# EAGLE schematic octanis_eps_v1 (EAGLE 7.2.0)
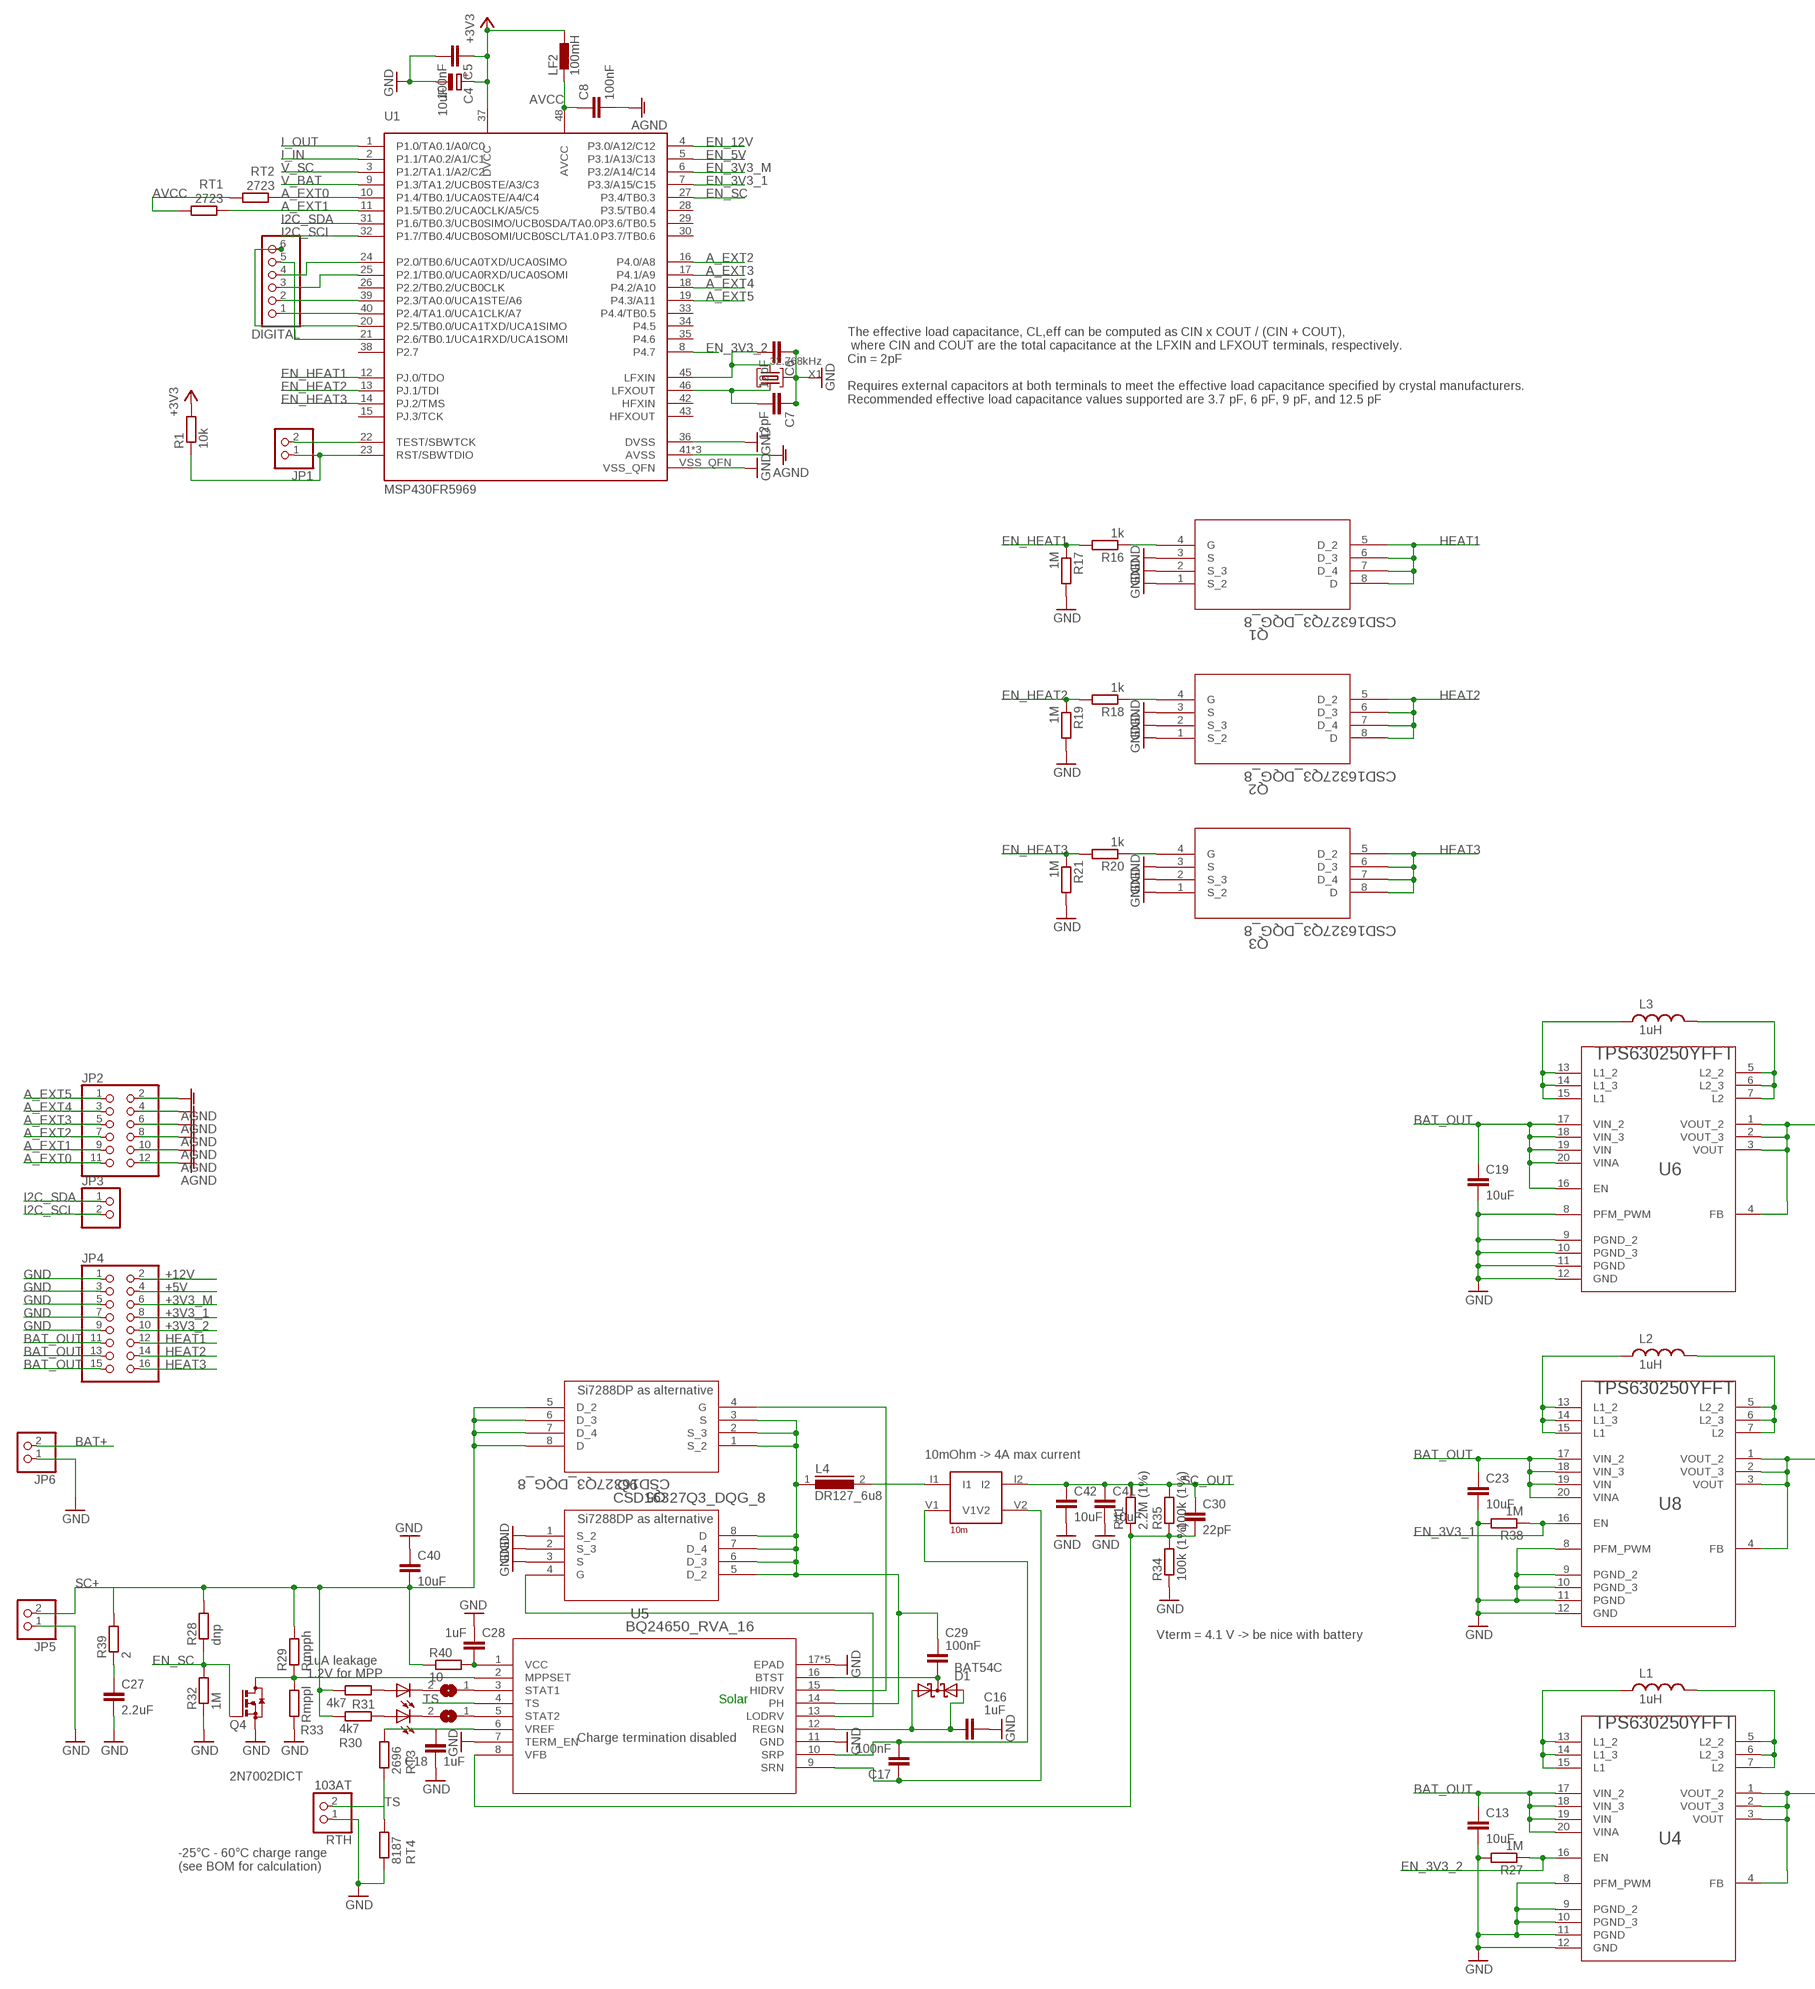
[diagram p0: schematic, sheet 1, part 1 of 2]
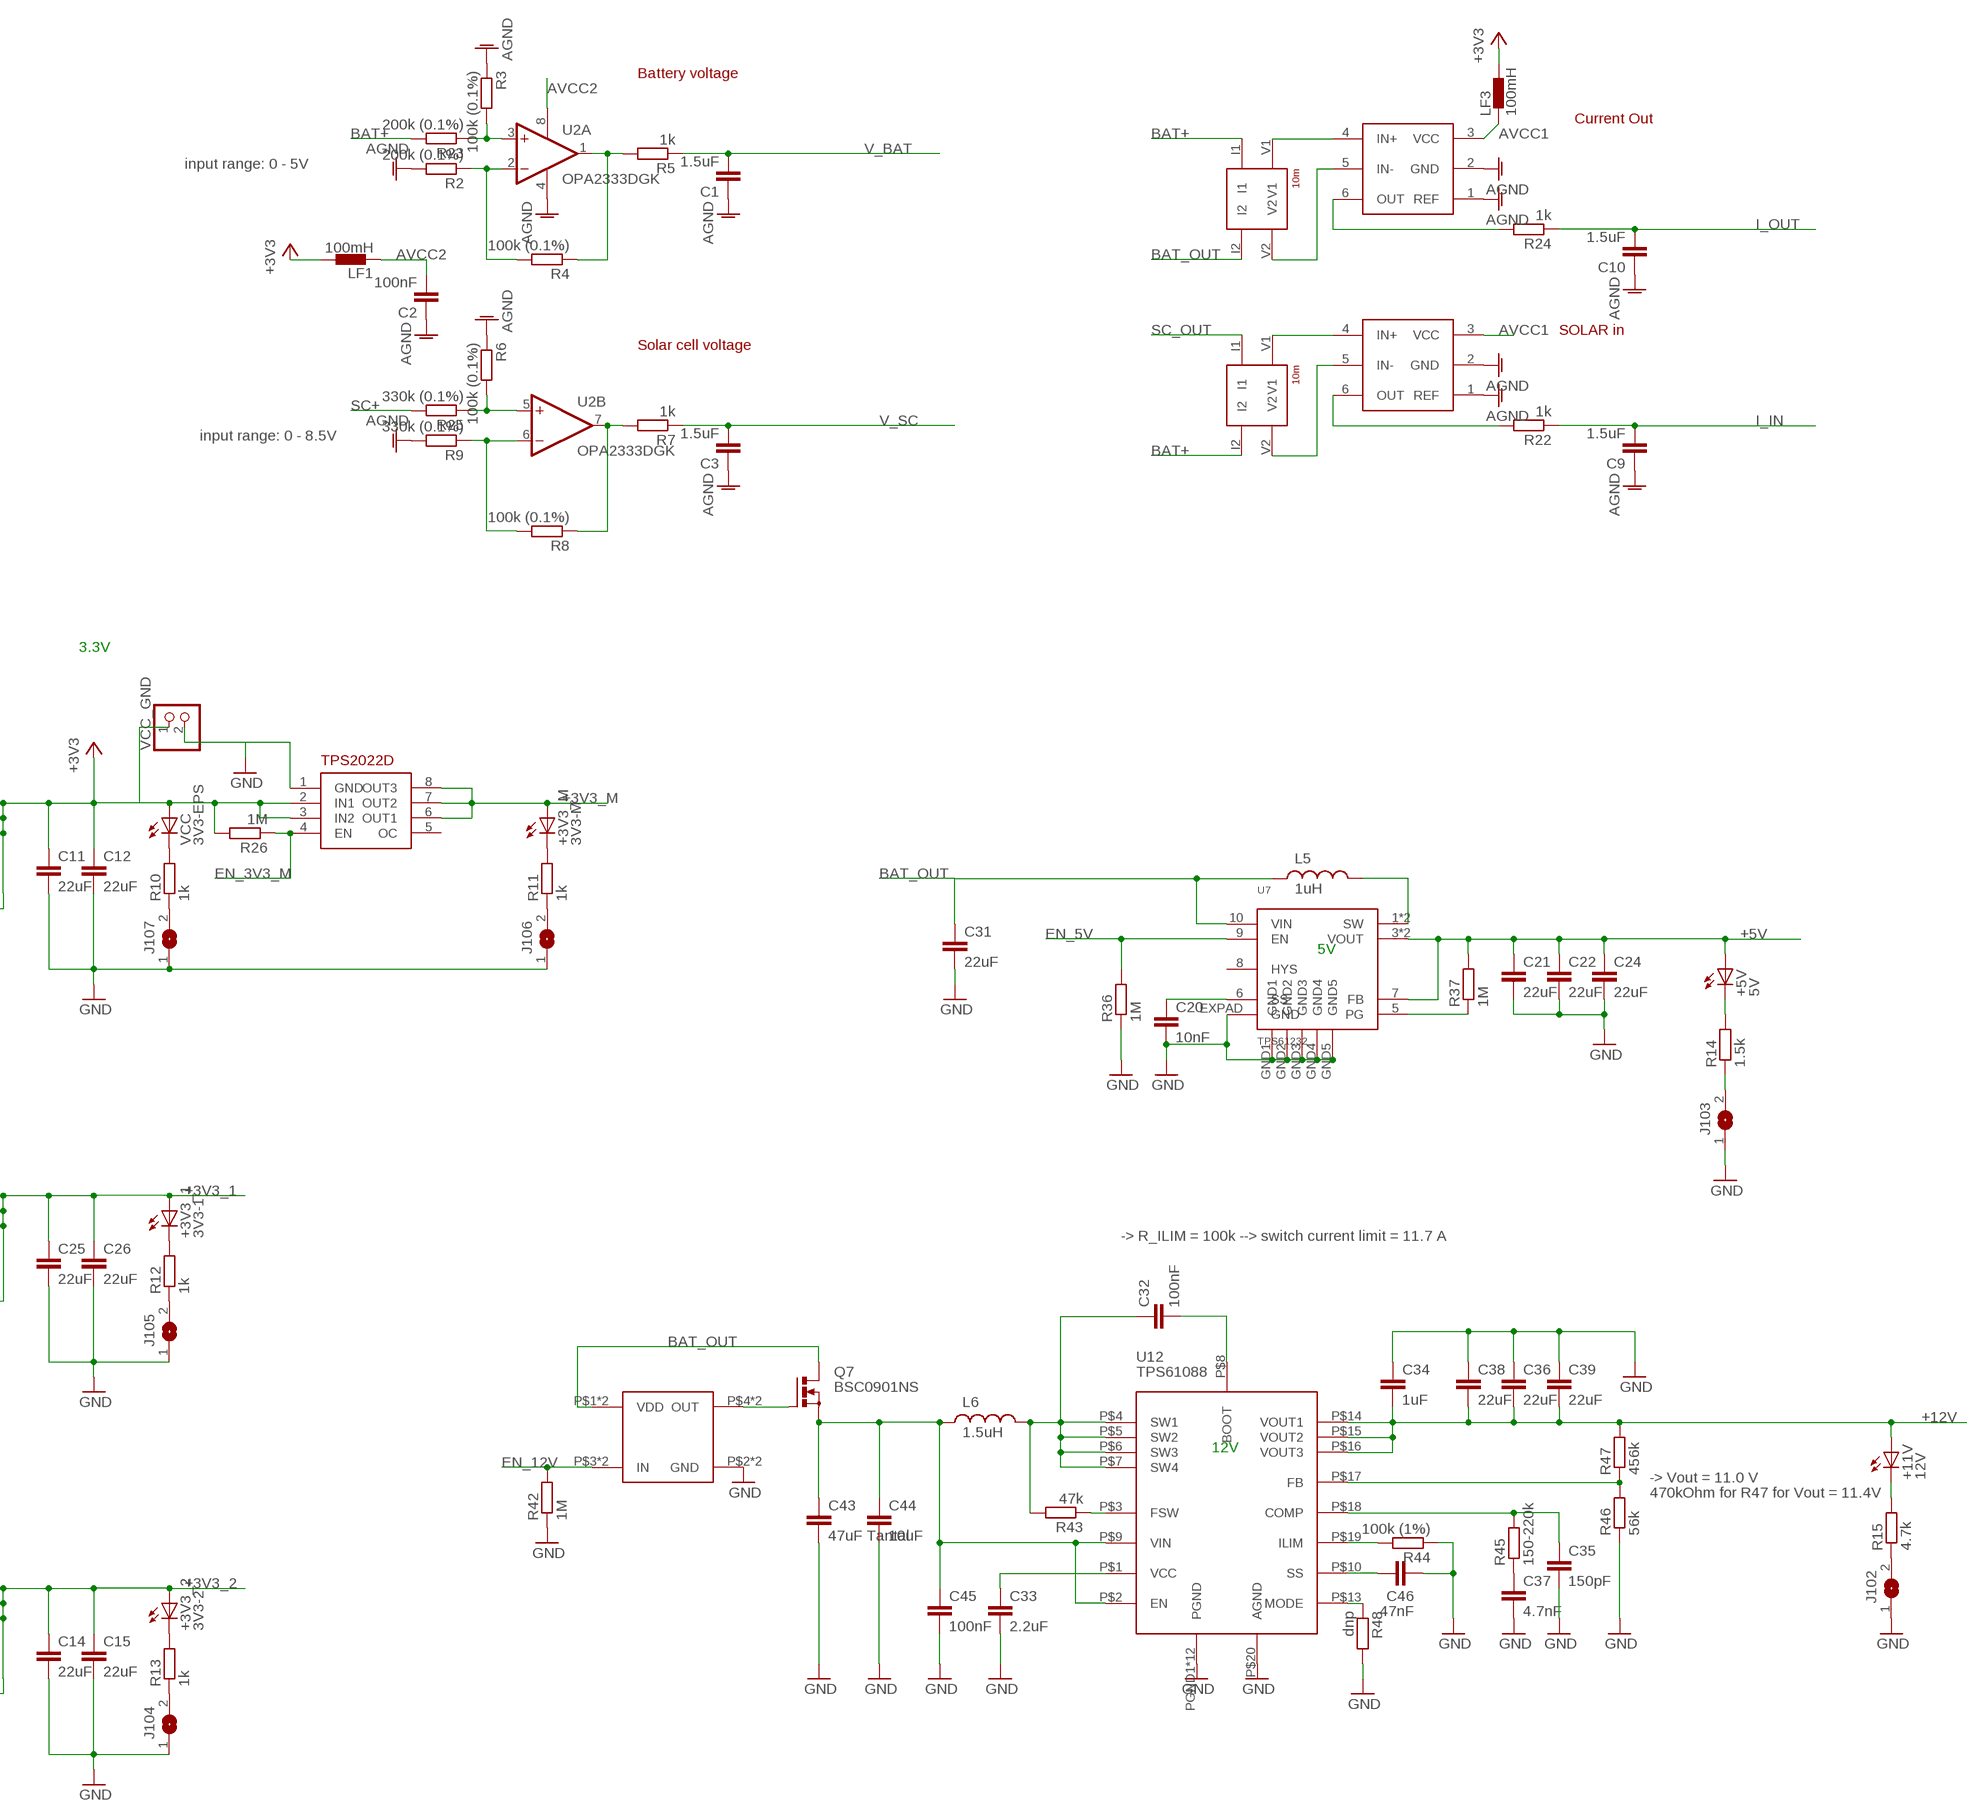
[diagram p1: schematic, sheet 1, part 2 of 2]

## Parts
+3V3_1  3V3-1  LEDCHIPLED_0603  [CHIPLED_0603]
+3V3_2  3V3-2  LEDCHIPLED_0603  [CHIPLED_0603]
+3V3_M  3V3-M  LEDCHIPLED_0603  [CHIPLED_0603]
+5V  5V  LEDCHIPLED_0603  [CHIPLED_0603]
+11V  12V  LEDCHIPLED_0603  [CHIPLED_0603]
C1  1.5uF  C-EUC0603  [C0603]
C2  100nF  C-EUC0603  [C0603]
C3  1.5uF  C-EUC0603  [C0603]
C4  10uF  CPOL-EUA/3216-18R  [A/3216-18R]
C5  100nF  C-EUC0603  [C0603]
C6  12pF  C-EUC0603  [C0603]
C7  12pF  C-EUC0603  [C0603]
C8  100nF  C-EUC0603  [C0603]
C9  1.5uF  C-EUC0603  [C0603]
C10  1.5uF  C-EUC0603  [C0603]
C11  22uF  C-EUC0805  [C0805]
C12  22uF  C-EUC0805  [C0805]
C13  10uF  C-EUC0805  [C0805]
C14  22uF  C-EUC0805  [C0805]
C15  22uF  C-EUC0805  [C0805]
C16  1uF  C-EUC0603  [C0603]
C17  100nF  C-EUC0603  [C0603]
C18  1uF  C-EUC0603  [C0603]
C19  10uF  C-EUC0805  [C0805]
C20  10nF  C-EUC0603  [C0603]
C21  22uF  C-EUC0805  [C0805]
C22  22uF  C-EUC0805  [C0805]
C23  10uF  C-EUC0805  [C0805]
C24  22uF  C-EUC0805  [C0805]
C25  22uF  C-EUC0805  [C0805]
C26  22uF  C-EUC0805  [C0805]
C27  2.2uF  C-EUC0603  [C0603]
C28  1uF  C-EUC0603  [C0603]
C29  100nF  C-EUC0603  [C0603]
C30  22pF  C-EUC0603  [C0603]
C31  22uF  C-EUC0603  [C0603]
C32  100nF  C-EUC0603  [C0603]
C33  2.2uF  C-EUC0603  [C0603]
C34  1uF  C-EUC0603  [C0603]
C35  150pF  C-EUC0603  [C0603]
C36  22uF  C-EUC0805  [C0805]
C37  4.7nF  C-EUC0603  [C0603]
C38  22uF  C-EUC0805  [C0805]
C39  22uF  C-EUC0805  [C0805]
C40  10uF  C-EUC0805  [C0805]
C41  10uF  C-EUC0805  [C0805]
C42  10uF  C-EUC0805  [C0805]
C43  47uF Tantal  C-EUC1210  [C1210]
C44  10uF  C-EUC0805  [C0805]
C45  100nF  C-EUC0603  [C0603]
C46  47nF  C-EUC0603  [C0603]
D1  BAT54C  [SOT23]
DIGITAL  PINHD-1X6B  [1X06-BIG]
J100  SJ  [SJ]
J101  SJ  [SJ]
J102  SJ  [SJ]
J103  SJ  [SJ]
J104  SJ  [SJ]
J105  SJ  [SJ]
J106  SJ  [SJ]
J107  SJ  [SJ]
JP1  PINHD-1X2  [1X02]
JP2  PINHD-2X6  [2X06]
JP3  PINHD-1X2  [1X02]
JP4  PINHD-2X8  [2X08]
JP5  PINHD-1X2  [1X02]
JP6  PINHD-1X2  [1X02]
L1  1uH  XFL4020  [XFL4020]
L2  1uH  XFL4020  [XFL4020]
L3  1uH  XFL4020  [XFL4020]
L4  DR127_6u8  DR127  [DR127]
L5  1uH  XFL4020  [XFL4020]
L6  1.5uH  XFL4020  [XFL4020]
LF1  100mH  BLM15HD601SN1  [0402]
LF2  100mH  BLM15HD601SN1  [0402]
LF3  100mH  BLM15HD601SN1  [0402]
Q1  CSD16327Q3_DQG_8  [DQG8]
Q2  CSD16327Q3_DQG_8  [DQG8]
Q3  CSD16327Q3_DQG_8  [DQG8]
Q4  BSS123  [SOT23]
Q5  CSD16327Q3_DQG_8  [DQG8]
Q6  CSD16327Q3_DQG_8  [DQG8]
Q7  BSC0901NS  BSC340N08NS3G  [PG-TDSON-8]
R1  10k  R-EU_R0603  [R0603]
R2  200k (0.1%)  R-EU_R0603  [R0603]
R3  100k (0.1%)  R-EU_R0603  [R0603]
R4  100k (0.1%)  R-EU_R0603  [R0603]
R5  1k  R-EU_R0603  [R0603]
R6  100k (0.1%)  R-EU_R0603  [R0603]
R7  1k  R-EU_R0603  [R0603]
R8  100k (0.1%)  R-EU_R0603  [R0603]
R9  330k (0.1%)  R-EU_R0603  [R0603]
R10  1k  R-EU_R0603  [R0603]
R11  1k  R-EU_R0603  [R0603]
R12  1k  R-EU_R0603  [R0603]
R13  1k  R-EU_R0603  [R0603]
R14  1.5k  R-EU_R0603  [R0603]
R15  4.7k  R-EU_R0603  [R0603]
R16  1k  R-EU_R0603  [R0603]
R17  1M  R-EU_R0603  [R0603]
R18  1k  R-EU_R0603  [R0603]
R19  1M  R-EU_R0603  [R0603]
R20  1k  R-EU_R0603  [R0603]
R21  1M  R-EU_R0603  [R0603]
R22  1k  R-EU_R0603  [R0603]
R23  200k (0.1%)  R-EU_R0603  [R0603]
R24  1k  R-EU_R0603  [R0603]
R25  330k (0.1%)  R-EU_R0603  [R0603]
R26  1M  R-EU_R0603  [R0603]
R27  1M  R-EU_R0603  [R0603]
R28  dnp  R-EU_R0603  [R0603]
R29  Rmpph  R-EU_R0603  [R0603]
R30  4k7  R-EU_R0603  [R0603]
R31  4k7  R-EU_R0603  [R0603]
R32  1M  R-EU_R0603  [R0603]
R33  Rmppl  R-EU_R0603  [R0603]
R34  100k (1%)  R-EU_R0603  [R0603]
R35  100k (1%)  R-EU_R0603  [R0603]
R36  1M  R-EU_R0603  [R0603]
R37  1M  R-EU_R0603  [R0603]
R38  1M  R-EU_R0603  [R0603]
R39  2  R-EU_R2010  [R2010]
R40  10  R-EU_R1206  [R1206]
R41  2.2M (1%)  R-EU_R0603  [R0603]
R42  1M  R-EU_R0603  [R0603]
R43  47k  R-EU_R0603  [R0603]
R44  100k (1%)  R-EU_R0603  [R0603]
R45  150-220k  R-EU_R0603  [R0603]
R46  56k  R-EU_R0603  [R0603]
R47  456k  R-EU_R0603  [R0603]
R48  dnp  R-EU_R0603  [R0603]
RS1  10m  CURRENT_RESISTOR  [4PADS_RESISTOR]
RS2  10m  CURRENT_RESISTOR  [4PADS_RESISTOR]
RS3  10m  CURRENT_RESISTOR  [4PADS_RESISTOR]
RT1  2723  R-EU_R0603  [R0603]
RT2  2723  R-EU_R0603  [R0603]
RT3  2696  R-EU_R0603  [R0603]
RT4  8187  R-EU_R0603  [R0603]
RTH  103AT  PINHD-1X2  [1X02]
STAT1  5V-ok  LEDCHIPLED_0603  [CHIPLED_0603]
STAT2  5V-ok  LEDCHIPLED_0603  [CHIPLED_0603]
U1  MSP430FR5969  [S-PVQFN-N48]
U2  OPA2333DGK  [MSOP08]
U3  TPS2022D  [SO8]
U4  TPS630250YFFT  [YFF0020AEBA]
U5  BQ24650_RVA_16  [RVA16_2P14X2P14]
U6  TPS630250YFFT  [YFF0020AEBA]
U7  TPS61232  [S-PVSON-N10]
U8  TPS630250YFFT  [YFF0020AEBA]
U9  INA213  [SC70-6]
U10  INA213  [SC70-6]
U11  MIC5019  [QFN-4]
U12  TPS61088  [R-PVQFN-N20]
VCC  3V3-EPS  LEDCHIPLED_0603  [CHIPLED_0603]
VCC_GND  PINHD-1X2  [1X02]
X1  32.768kHz  MS3V-T1R  [MS3V-T1R]

## Nets
+3V3: C4.+ C5.1 C11.1 C12.1 LF1.2 LF2.2 LF3.2 R1.2 R26.2 U1.37(DVCC) U3.2(IN1) U3.3(IN2) U6.1(VOUT_2) U6.2(VOUT_3) U6.3(VOUT) U6.4(FB) VCC.A VCC_GND.1
+3V3_1: +3V3_1.A C25.1 C26.1 JP4.8 U8.1(VOUT_2) U8.2(VOUT_3) U8.3(VOUT) U8.4(FB)
+3V3_2: +3V3_2.A C14.1 C15.1 JP4.10 U4.1(VOUT_2) U4.2(VOUT_3) U4.3(VOUT) U4.4(FB)
+3V3_M: +3V3_M.A JP4.6 U3.6(OUT1) U3.7(OUT2) U3.8(OUT3)
+5V [fine]: +5V.A C21.1 C22.1 C24.1 JP4.4 R37.2 U7.3(VOUT) U7.4(VOUT) U7.7(FB)
+12V [fine]: +11V.A C34.2 C36.2 C38.2 C39.2 JP4.2 R47.2 U12.P$14(VOUT1) U12.P$15(VOUT2) U12.P$16(VOUT3)
A_EXT0: JP2.11 RT2.2 U1.10(P1.4/TB0.1/UCA0STE/A4/C4)
A_EXT1: JP2.9 RT1.2 U1.11(P1.5/TB0.2/UCA0CLK/A5/C5)
A_EXT2: JP2.7 U1.16(P4.0/A8)
A_EXT3: JP2.5 U1.17(P4.1/A9)
A_EXT4: JP2.3 U1.18(P4.2/A10)
A_EXT5: JP2.1 U1.19(P4.3/A11)
AGND: C1.1 C2.1 C3.1 C8.2 C9.1 C10.1 JP2.2 JP2.4 JP2.6 JP2.8 JP2.10 JP2.12 R2.2 R3.1 R6.1 R9.2 U1.41(AVSS) U1.44(AVSS) U1.47(AVSS) U2.4(P:V-) U9.1(REF) U9.2(GND) U10.1(REF) U10.2(GND)
AVCC: C8.1 LF2.1 RT1.1 RT2.1 U1.48(AVCC)
AVCC1: LF3.1 U9.3(VCC) U10.3(VCC)
AVCC2: C2.2 LF1.1 U2.8(P:V+)
BAT+: JP6.2 R23.2 RS2.I2 RS3.I1
BAT_11V: C43.1 C44.1 C45.1 L6.P$1 Q7.1(S) Q7.2(S) Q7.3(S) U12.P$2(EN) U12.P$9(VIN)
BAT_OUT: C13.1 C19.1 C23.1 C31.1 JP4.11 JP4.13 JP4.15 L5.P$1 Q7.5(D) Q7.6(D) Q7.7(D) Q7.8(D) RS3.I2 U4.17(VIN_2) U4.18(VIN_3) U4.19(VIN) U4.20(VINA) U6.16(EN) U6.17(VIN_2) U6.18(VIN_3) U6.19(VIN) U6.20(VINA) U7.10(VIN) U8.17(VIN_2) U8.18(VIN_3) U8.19(VIN) U8.20(VINA) U11.P1(VDD) U11.P$1(VDD)
EN_3V3_1: R38.1 U1.7(P3.3/A15/C15) U8.16(EN)
EN_3V3_2: R27.1 U1.8(P4.7) U4.16(EN)
EN_3V3_M: R26.1 U1.6(P3.2/A14/C14) U3.4(EN)
EN_5V: R36.2 U1.5(P3.1/A13/C13) U7.9(EN)
EN_12V: R42.2 U1.4(P3.0/A12/C12) U11.P3(IN) U11.P$3(IN)
EN_HEAT1: R16.2 R17.1 U1.12(PJ.0/TDO)
EN_HEAT2: R18.2 R19.1 U1.13(PJ.1/TDI)
EN_HEAT3: R20.2 R21.1 U1.14(PJ.2/TMS)
EN_SC: Q4.1(G) R28.1 R32.2 U1.27(P3.4/TB0.3)
GND [power]: C4.- C5.2 C6.1 C7.1 C11.2 C12.2 C13.2 C14.2 C15.2 C16.2 C18.2 C19.2 C20.2 C21.2 C22.2 C23.2 C24.2 C25.2 C26.2 C27.2 C28.2 C31.2 C33.2 C34.1 C35.2 C36.1 C37.2 C38.1 C39.1 C40.1 C41.2 C42.2 C43.2 C44.2 C45.2 C46.2 J102.1 J103.1 J104.1 J105.1 J106.1 J107.1 JP4.1 JP4.3 JP4.5 JP4.7 JP4.9 JP5.1 JP6.1 Q1.1(S_2) Q1.2(S_3) Q1.3(S) Q2.1(S_2) Q2.2(S_3) Q2.3(S) Q3.1(S_2) Q3.2(S_3) Q3.3(S) Q4.2(S) Q6.1(S_2) Q6.2(S_3) Q6.3(S) R17.2 R19.2 R21.2 R27.2 R32.1 R33.1 R34.1 R36.1 R38.2 R42.1 R44.1 R46.1 R48.2 RT4.2 RTH.1 U1.36(DVSS) U1.VSS_QFN U3.1(GND) U4.8(PFM_PWM) U4.9(PGND_2) U4.10(PGND_3) U4.11(PGND) U4.12(GND) U5.7(TERM_EN) U5.11(GND) U5.17(EPAD) U5.V(EPAD) U5.V_1(EPAD) U5.V_2(EPAD) U5.V_3(EPAD) U6.8(PFM_PWM) U6.9(PGND_2) U6.10(PGND_3) U6.11(PGND) U6.12(GND) U7.EXPAD(GND) U7.GND1 U7.GND2 U7.GND3 U7.GND4 U7.GND5 U8.8(PFM_PWM) U8.9(PGND_2) U8.10(PGND_3) U8.11(PGND) U8.12(GND) U11.P2(GND) U11.P$2(GND) U12.P$20(AGND) U12.PGND1(PGND) U12.PGND2(PGND) U12.PGND3(PGND) U12.PGND4(PGND) U12.PGND5(PGND) U12.PGND6(PGND) U12.PGND7(PGND) U12.PGND8(PGND) U12.PGND9(PGND) U12.PGND10(PGND) U12.PGND11(PGND) U12.PGND12(PGND) VCC_GND.2 X1.P3(GND)
HEAT1: JP4.12 Q1.5(D_2) Q1.6(D_3) Q1.7(D_4) Q1.8(D)
HEAT2: JP4.14 Q2.5(D_2) Q2.6(D_3) Q2.7(D_4) Q2.8(D)
HEAT3: JP4.16 Q3.5(D_2) Q3.6(D_3) Q3.7(D_4) Q3.8(D)
I2C_SCL: JP3.2 U1.32(P1.7/TB0.4/UCB0SOMI/UCB0SCL/TA1.0)
I2C_SDA: JP3.1 U1.31(P1.6/TB0.3/UCB0SIMO/UCB0SDA/TA0.0)
I_IN: C9.2 R22.1 U1.2(P1.1/TA0.2/A1/C1)
I_OUT: C10.2 R24.1 U1.1(P1.0/TA0.1/A0/C0)
IND: L5.P$2 U7.1(SW) U7.2(SW)
LED5: +5V.C R14.2
N$1: L3.P$1 U6.13(L1_2) U6.14(L1_3) U6.15(L1)
N$2: R37.1 U7.5(PG)
N$3: L3.P$2 U6.5(L2_2) U6.6(L2_3) U6.7(L2)
N$4: L4.2 RS1.I1
N$5: C20.1 U7.6(SS)
N$6: L2.P$1 U8.13(L1_2) U8.14(L1_3) U8.15(L1)
N$7: L2.P$2 U8.5(L2_2) U8.6(L2_3) U8.7(L2)
N$9: R48.1 U12.P$13(MODE)
N$10: Q7.4(G) U11.P4(OUT) U11.P$4(OUT)
N$11: L1.P$1 U4.13(L1_2) U4.14(L1_3) U4.15(L1)
N$12: L1.P$2 U4.5(L2_2) U4.6(L2_3) U4.7(L2)
N$13: JP1.1 R1.1 U1.23(RST/SBWTDIO)
N$14: J103.2 R14.1
N$15: JP1.2 U1.22(TEST/SBWTCK)
N$16: C7.2 U1.46(LFXOUT) X1.P1
N$17: C6.2 U1.45(LFXIN) X1.P2
N$18: DIGITAL.3 U1.25(P2.1/TB0.0/UCA0RXD/UCA0SOMI)
N$19: R4.1 R5.2 U2.1(A:OUT)
N$20: R2.1 R4.2 U2.2(A:-IN)
N$21: R3.2 R23.1 U2.3(A:+IN)
N$22: R7.2 R8.1 U2.7(B:OUT)
N$23: R8.2 R9.1 U2.6(B:-IN)
N$24: R6.2 R25.1 U2.5(B:+IN)
N$25: R24.2 U10.6(OUT)
N$26: R22.2 U9.6(OUT)
N$27: Q3.4(G) R20.1
N$28: DIGITAL.4 U1.24(P2.0/TB0.6/UCA0TXD/UCA0SIMO)
N$29: DIGITAL.2 U1.39(P2.3/TA0.0/UCA1STE/A6)
N$30: DIGITAL.1 U1.40(P2.4/TA1.0/UCA1CLK/A7)
N$31: Q2.4(G) R18.1
N$32: RS3.V1 U10.4(IN+)
N$33: RS3.V2 U10.5(IN-)
N$34: RS2.V1 U9.4(IN+)
N$35: RS2.V2 U9.5(IN-)
N$36: DIGITAL.5 U1.21(P2.6/TB0.1/UCA1RXD/UCA1SOMI)
N$37: Q1.4(G) R16.1
N$38: C32.2 U12.P$8(BOOT)
N$39: +3V3_M.C R11.2
N$40: J106.2 R11.1
N$41: DIGITAL.6 U1.20(P2.5/TB0.0/UCA1TXD/UCA1SIMO)
N$42: C27.1 R39.1
N$43: R10.2 VCC.C
N$45: J107.2 R10.1
N$46: +3V3_2.C R13.2
N$47: J104.2 R13.1
N$48: +11V.C R15.2
N$49: J102.2 R15.1
N$50: C32.1 L6.P$2 R43.2 U12.P$4(SW1) U12.P$5(SW2) U12.P$6(SW3) U12.P$7(SW4)
N$51: +3V3_1.C R12.2
N$52: J105.2 R12.1
N$53: R43.1 U12.P$3(FSW)
N$54: C37.1 R45.1
N$56: C46.1 U12.P$10(SS)
N$57: R44.2 U12.P$19(ILIM)
N$58: C35.1 R45.2 U12.P$18(COMP)
N$59: C33.1 U12.P$1(VCC)
N$60: R46.2 R47.1 U12.P$17(FB)
N$64: Q4.3(D) R29.1 R33.2 U5.2(MPPSET)
N$66: R31.1 STAT1.A
N$67: J101.2 STAT2.C
N$68: J100.2 STAT1.C
N$69: R30.1 STAT2.A
N$70: J101.1 U5.5(STAT2)
N$71: J100.1 U5.3(STAT1)
N$72: C18.1 RT3.1 U5.6(VREF)
N$73: C28.1 R40.2 U5.1(VCC)
N$76: C29.1 L4.1 Q5.1(S_2) Q5.2(S_3) Q5.3(S) Q6.5(D_2) Q6.6(D_3) Q6.7(D_4) Q6.8(D) U5.14(PH)
N$77: C17.2 RS1.V1 U5.10(SRP)
N$78: C17.1 RS1.V2 U5.9(SRN)
N$80: Q5.4(G) U5.15(HIDRV)
N$81: Q6.4(G) U5.13(LODRV)
N$82: C30.2 R34.2 R35.1 R41.1 U5.8(VFB)
N$84: C16.1 D1.1(A1) D1.2(A2) U5.12(REGN)
N$85: C29.2 D1.3(CC) U5.16(BTST)
SC+: C40.2 JP5.2 Q5.5(D_2) Q5.6(D_3) Q5.7(D_4) Q5.8(D) R25.2 R28.2 R29.2 R30.2 R31.2 R39.2 R40.1
SC_OUT: C30.1 C41.1 C42.1 R35.2 R41.2 RS1.I2 RS2.I1
TS: RT3.2 RT4.1 RTH.2 U5.4(TS)
V_BAT: C1.2 R5.1 U1.9(P1.3/TA1.2/UCB0STE/A3/C3)
V_SC: C3.2 R7.1 U1.3(P1.2/TA1.1/A2/C2)
Unconnected: Q7.TH U1.15(PJ.3/TCK) U1.26(P2.2/TB0.2/UCB0CLK) U1.28(P3.5/TB0.4) U1.29(P3.6/TB0.5) U1.30(P3.7/TB0.6) U1.33(P4.4/TB0.5) U1.34(P4.5) U1.35(P4.6) U1.38(P2.7) U1.42(HFXIN) U1.43(HFXOUT) U3.5(OC) U7.8(HYS)

## Notes on the sheet
- The effective load capacitance, CL,eff can be computed as CIN x COUT / (CIN + COUT),
   where CIN and COUT are the total capacitance at the LFXIN and LFXOUT terminals, respectively. 
  Cin = 2pF
  
  Requires external capacitors at both terminals to meet the effective load capacitance specified by crystal manufacturers. 
  Recommended effective load capacitance values supported are 3.7 pF, 6 pF, 9 pF, and 12.5 pF
- Battery voltage
- Current Out
- input range: 0 - 5V
- SOLAR in
- Solar cell voltage
- input range: 0 - 8.5V
- 3.3V
- 5V
- Si7288DP as alternative
- 10mOhm -> 4A max current
- -> R_ILIM = 100k --> switch current limit = 11.7 A
- Si7288DP as alternative
- Vterm = 4.1 V -> be nice with battery
- 1uA leakage
- 1.2V for MPP | 12V
- Solar | -> Vout = 11.0 V
- 470kOhm for R47 for Vout = 11.4V
- Charge termination disabled
- 2N7002DICT
- -25°C - 60°C charge range
  (see BOM for calculation)

## Library data of the parts
+3V3_1 +3V3_2 +3V3_M +5V +11V STAT1 STAT2 VCC = adafruit:LED: LED OSRAM: - CHIPLED LG R971, LG N971, LY N971, LG Q971, LY Q971, LO R971, LY R971 LH N974, LH R974 LS Q976, LO Q976, LY Q976 LO Q996 - Hyper CHIPLED LW Q18S LB Q993, LB Q99A, LB R99A - SideLED LS A670, LO A670, LY A670, LG A670, LP A670 LB A673, LV A673, LT A673, LW A673 LH A674 LY A675 LS A676, LA A676, LO A676, LY A676, LW A676 LS A679, LY A679, LG A679 - Hyper Micro SIDELED® LS Y876, LA Y876, LO Y876, LY Y876 LT Y87S - SmartLED LW L88C, LW L88S LB L89C, LB L89S, LG L890 LS L89K, LO L89K, LY L89K LS L896, LA L896, LO L896, LY L896 - TOPLED LS T670, LO T670, LY T670, LG T670, LP T670 LSG T670, LSP T670, LSY T670, LOP T670, LYG T670 LG T671, LOG T671, LSG T671 LB T673, LV T673, LT T673, LW T673 LH T674 LS T676, LA T676, LO T676, LY T676, LB T676, LH T676, LSB T676, LW T676 LB T67C, LV T67C, LT T67C, LS T67K, LO T67K, LY T67K, LW E67C LS E67B, LA E67B, LO E67B, LY E67B, LB E67C, LV E67C, LT E67C LW T67C LS T679, LY T679, LG T679 LS T770, LO T770, LY T770, LG T770, LP T770 LB T773, LV T773, LT T773, LW T773 LH T774 LS E675, LA E675, LY E675, LS T675 LS T776, LA T776, LO T776, LY T776, LB T776 LHGB T686 LT T68C, LB T68C - Hyper Mini TOPLED® LB M676 - Mini TOPLED Santana® LG M470 LS M47K, LO M47K, LY M47K Source: http://www.osram.convergy.de/
C1-C3 C5-C10 C16-C18 C20 C27-C35 C37 C43 C45 C46 = rcl:C-EU: CAPACITOR, European symbol
C4 = rcl:CPOL-EU: POLARIZED CAPACITOR, European symbol
C11-C15 C19 C21-C26 C36 C38-C42 C44 = resistor:C-EU: CAPACITOR, European symbol
D1 = diode:BAT54C: Schottky Diodes Source: Fairchild .. BAT54.pdf
DIGITAL = adafruit:PINHD-1X6: PIN HEADER
J100-J107 = jumper:SJ: SMD solder JUMPER
JP1 JP3 JP5 JP6 RTH VCC_GND = Headerlibrary:PINHD-1X2: PIN HEADER
JP2 = Headerlibrary:PINHD-2X6: PIN HEADER
JP4 = Headerlibrary:PINHD-2X8: PIN HEADER
L1-L3 L5 L6 = Coilcraft:XFL4020
L4 = inductors:DR127: High Power Density, High Efficiency, Shielded Inductors Source: coiltronics_dr_series.pdf
LF1-LF3 = inductors:BLM15H: EMIFIL (R) Chip Ferrite Bead for GHz Noise Source: http://www.murata.com/ Ferrite Bead BLM15H.pdf
Q1-Q3 Q5 Q6 = texasinstruments:CSD16327Q3_DQG_8; DATASHEETURL: http://www.ti.com/lit/gpn/CSD16327Q3; DESCRIPTION: N-Channel NexFET Power MOSFET; FAMILY_NAME: N-Channel MOSFET Transistors; GENERIC_PART_NUMBER: CSD16327Q3; INDUSTRY_STD_PKG_TYPE: SON; MANUFACTURER: Texas Instruments; PACKAGE_DESIGNATOR: DQG; PIN_COUNT: 8
Q4 = transistor-small-signal:BSS123: N-CHANNEL MOS FET
Q7 = transistor-power:BSC340N08NS3G: OptiMOS TM 3 Power-Transistor BSC340N08NS3 G Source: Data sheet <http://www.infineon.com/dgdl/BSC340N08NS3G_rev2.4.pdf?folderId=db3a304313b8b5a60113cee8763b02d7&fileId=db3a30431add1d95011ae81c21f2563a>
R1-R25 R28-R37 R39-R42 RT1-RT4 = rcl:R-EU_: RESISTOR, European symbol
R26 R27 R38 R43-R48 = resistor:R-EU_: RESISTOR, European symbol
RS1-RS3 = Octanis1_EPS:CURRENT_RESISTOR
U1 = chips:MSP430FR5969
U2 = linear:OPA2333: DUAL 1.8V, microPOWER CMOS OPERATIONAL AMPLIFIERS Zerø-Drift Series Source: Texas Instruments (Burr-Brown) .. U11 opa333 Operational Amp.pdf
U3 = Octanis1_EPS:TPS2022D: TEXAS INSTRUMENTS - TPS2022D - IC, 1.5A PWR DIST SWITCH 8SOIC
U4 U6 U8 = texasinstruments:TPS630250YFFT; ADDRESS1: Not shown in title block; ADDRESS2: Not shown in title block; ADDRESS3: Not shown in title block; ADDRESS4: Not shown in title block; ALTERNATEMANUFACTURER: None; APPROVEDBY: Not shown in title block; AUTHOR: Not shown in title block; CHECKEDBY: Not shown in title block; COMPANYNAME: Not shown in title block; COMPONENTLINK1DESCRIPTION: Datasheet Link; COMPONENTLINK1URL: https://sps06.itg.ti.com/sites/KMS/crossdivteams/altium/docs/ComponentDatasheets/SLVSBJ9_TPS63025.pdf; COMPTYPE: IC; CURRENTDATE: Not shown in title block; CURRENTTIME: Not shown in title block; DATE: Not shown in title block; DESIGNATOR: U?; DOCUMENTFULLPATHANDNAME: Not shown in title block; DOCUMENTNAME: Not shown in title block; DOCUMENTNUMBER: 1; ENGINEER: Not shown in title block; IMAGEPATH: Not shown in title block; LATESTREVISIONDATE: 2014-04-03; MANUFACTURER: Texas Instruments; MODIFIEDDATE: Not shown in title block; MOUNTTYPE: SMT; ORGANIZATION: Not shown in title block; PACKAGEREFERENCE: YFF0020AEBA; PARTNUMBER: TPS630250YFF; PIN_COUNT: 20; PROJECTNAME: *; PUBLISHER: Texas Instruments; REVISION: Use project parameter SCH_Rev; ROHS: Y; RULE: *; SHEETNUMBER: 1; SHEETTOTAL: 1; SYMBOLCREATOR: a0411947; SYMBOLVERSION: 2014-03-11; TIME: Not shown in title block
U5 = octanis_eps_v05:BQ24650_RVA_16; DATASHEETURL: http://www.ti.com/lit/gpn/BQ24650; DESCRIPTION: High Efficiency Synchronous Switch-Mode Charger Controller ? Solar Battery Charger; FAMILY_NAME: BATTERY CHARGE MANAGEMENT; GENERIC_PART_NUMBER: BQ24650; INDUSTRY_STD_PKG_TYPE: VQFN; MANUFACTURER: Texas Instruments; PACKAGE_DESIGNATOR: RVA; PIN_COUNT: 16
U7 = texasinstruments:TPS61232: Up to 96% Efficiency Synchronous Boost Converter 3.3 V to 5 V Power Conversion with 2.1 A Output Current Input Supply Voltage Supervisor with Adjustable Threshold/ Hysteresis Power Save Mode for Light Load Efficiency Load Disconnect During Shutdown Output Over Voltage Protection Programmable Soft Start Power Good Output Input Voltage Range: 2.3 V to 5.5 V Output Voltage Range: 2.5 V to 5.5 V 2 MHz Switching Frequency Output Capacitor Discharge (TPS61231) 3 mm × 3 mm × 0.9 mm SON Package
U9 U10 = Octanis1_EPS:INA213: Voltage Output, High or Low Side Measurement, Bi-Directional Zer ø -Drift Series Current-Shunt Monitor
U11 = Octanis1_EPS:MIC5019
U12 = texasinstruments:TPS61088
X1 = microcrystal:MS3V-T1R

## Net classes
0 default: clearance 0.152 mm
1 power: width 0.203 mm, drill 0.305 mm, clearance 0.152 mm
3 fine: width 0.406 mm, drill 0.61 mm, clearance 0.152 mm